# EAGLE design LPC1114 -- Valdez Mutant v.02 (EAGLE 7.0.0)
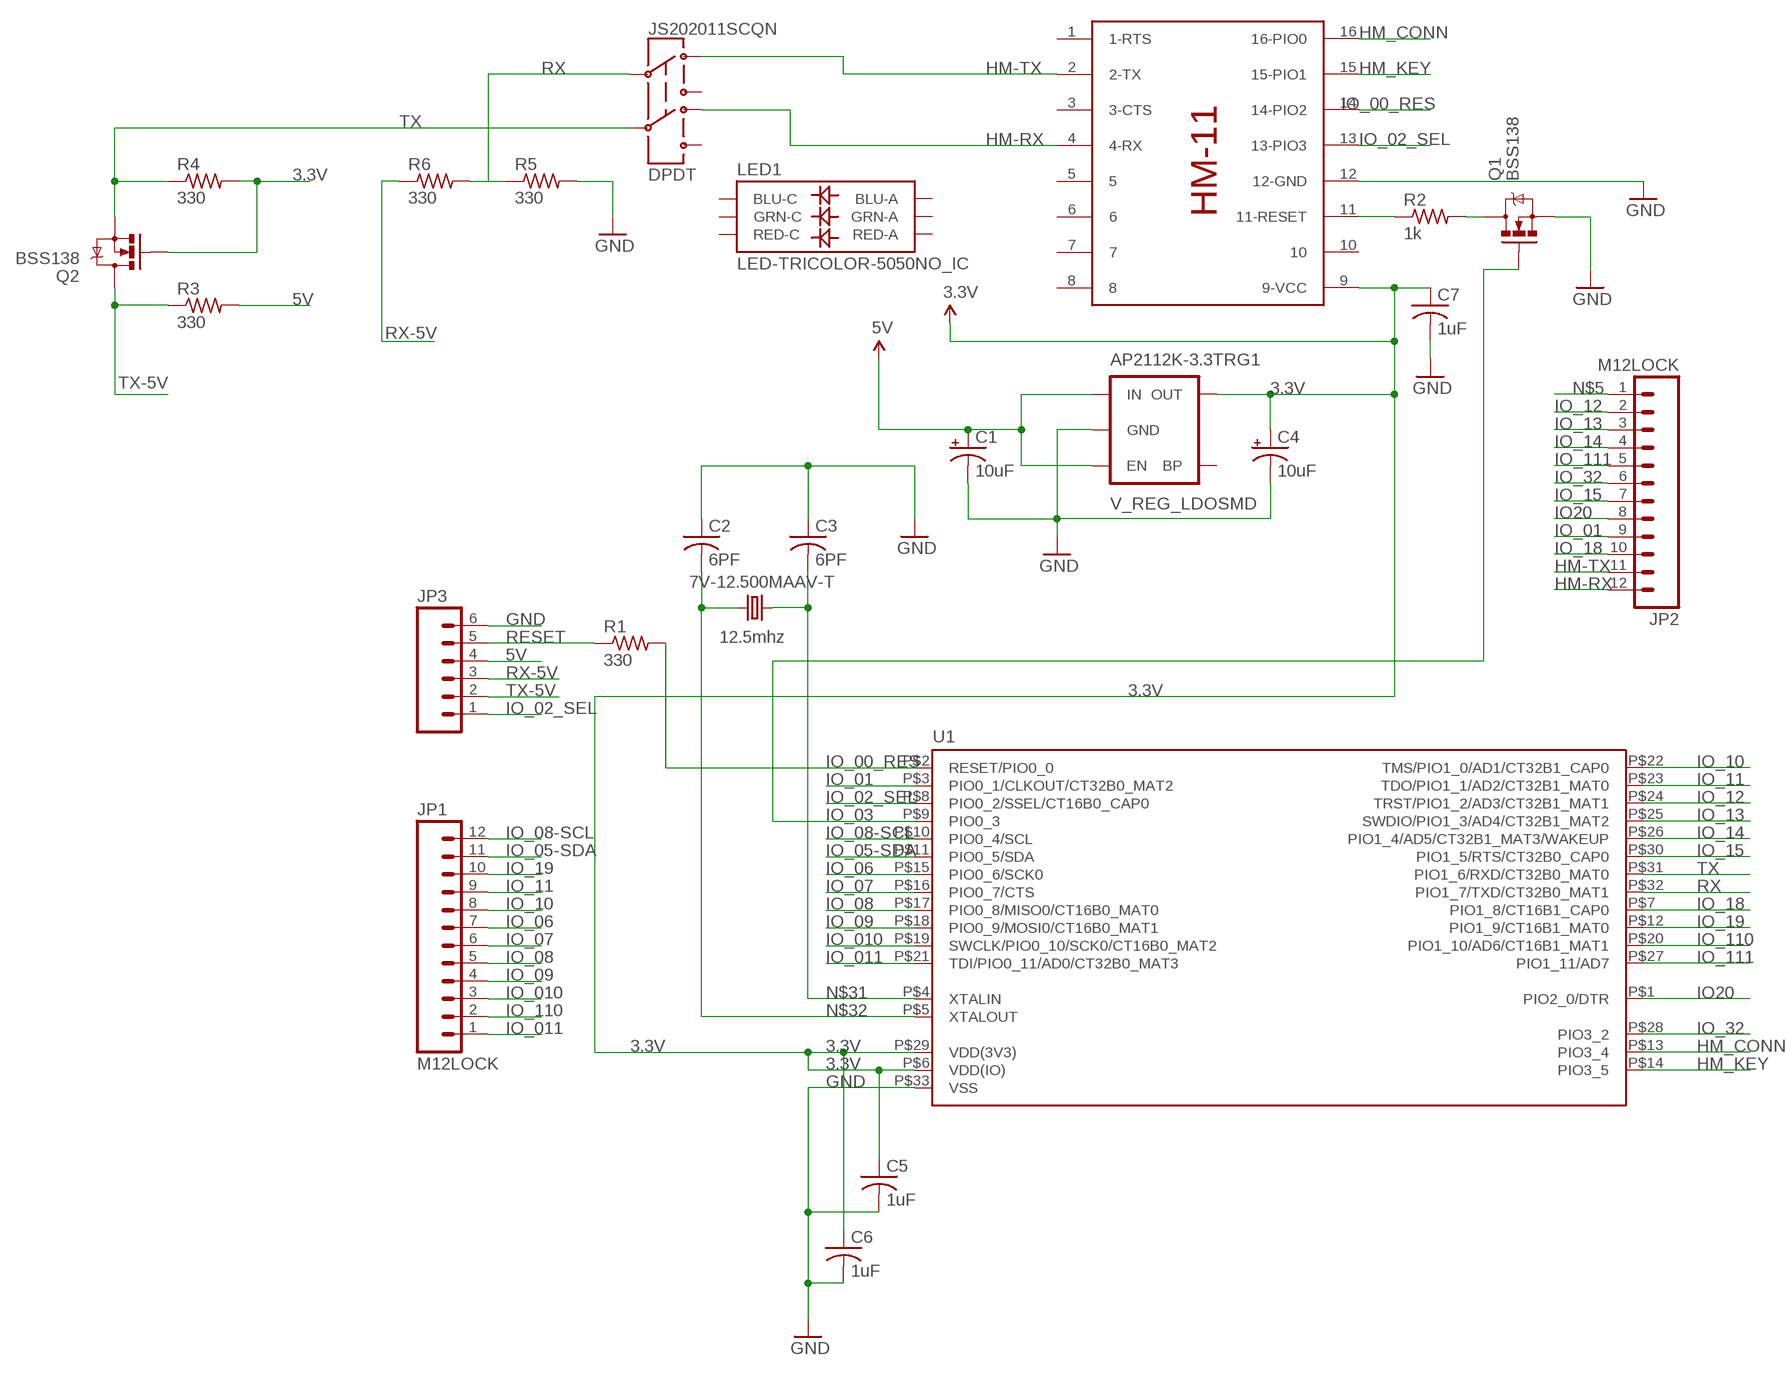
[diagram p0: schematic, sheet 1]

## Parts
7V-12.500MAAV-T  12.5mhz  CRYSTAL5X3  [CRYSTAL-SMD-5X3]
AP2112K-3.3TRG1  V_REG_LDOSMD  [SOT23-5]
C1  10uF  CAP_POL1206  [EIA3216]
C2  6PF  C-USC0402K  [C0402K]
C3  6PF  C-USC0402K  [C0402K]
C4  10uF  CAP_POL1206  [EIA3216]
C5  1uF  C-USC0402K  [C0402K]
C6  1uF  C-USC0402K  [C0402K]
C7  1uF  C-USC0402K  [C0402K]
JP1  M12LOCK  [1X12_LOCK]
JP2  M12LOCK  [1X12_LOCK]
JP3  M06LOCK  [1X06_LOCK]
JS202011SCQN  DPDT  SWITCH-DPDTAYZ0202  [AYZ0202]
LED1  LED-TRICOLOR-5050NO_IC  [LED-TRICOLOR-5050]
Q1  BSS138  MOSFET-NCHANNELBSS138  [SOT23]
Q2  BSS138  MOSFET-NCHANNELBSS138  [SOT23]
R1  330  R-US_R0402  [R0402]
R2  1k  R-US_R0402  [R0402]
R3  330  R-US_R0402  [R0402]
R4  330  R-US_R0402  [R0402]
R5  330  R-US_R0402  [R0402]
R6  330  R-US_R0402  [R0402]
U1  LPC1113/4_QFN  [HVQFN33-7X7]
U$1  HM-11  [HM-11]

## Nets
3.3V: AP2112K-3.3TRG1.5(OUT) C4.A(+) C5.1 C6.1 C7.1 Q2.1(G) R4.2 U1.P$6(VDD(IO)) U1.P$29(VDD(3V3)) U$1.9(9-VCC)
5V: AP2112K-3.3TRG1.1(IN) AP2112K-3.3TRG1.3(EN) C1.A(+) JP3.4 R3.2
GND: AP2112K-3.3TRG1.2(GND) C1.C(-) C2.1 C3.1 C4.C(-) C5.2 C6.2 C7.2 JP3.6 Q1.2(S) R5.2 U1.P$33(VSS) U$1.12(12-GND)
HM-RX: JP2.12 JS202011SCQN.4 U$1.4(4-RX)
HM-TX: JP2.11 JS202011SCQN.1 U$1.2(2-TX)
HM_CONN: U1.P$13(PIO3_4) U$1.16(16-PIO0)
HM_KEY: U1.P$14(PIO3_5) U$1.15(15-PIO1)
IO20: JP2.8 U1.P$1(PIO2_0/DTR)
IO_00_RES: R1.2 U1.P$2(RESET/PIO0_0) U$1.14(14-PIO2)
IO_01: JP2.9 U1.P$3(PIO0_1/CLKOUT/CT32B0_MAT2)
IO_02_SEL: JP3.1 U1.P$8(PIO0_2/SSEL/CT16B0_CAP0) U$1.13(13-PIO3)
IO_03: Q1.1(G) U1.P$9(PIO0_3)
IO_05-SDA: JP1.11 U1.P$11(PIO0_5/SDA)
IO_06: JP1.7 U1.P$15(PIO0_6/SCK0)
IO_07: JP1.6 U1.P$16(PIO0_7/CTS)
IO_08: JP1.5 U1.P$17(PIO0_8/MISO0/CT16B0_MAT0)
IO_08-SCL: JP1.12 U1.P$10(PIO0_4/SCL)
IO_09: JP1.4 U1.P$18(PIO0_9/MOSI0/CT16B0_MAT1)
IO_10: JP1.8 U1.P$22(TMS/PIO1_0/AD1/CT32B1_CAP0)
IO_010: JP1.3 U1.P$19(SWCLK/PIO0_10/SCK0/CT16B0_MAT2)
IO_11: JP1.9 U1.P$23(TDO/PIO1_1/AD2/CT32B1_MAT0)
IO_011: JP1.1 U1.P$21(TDI/PIO0_11/AD0/CT32B0_MAT3)
IO_12: JP2.2 U1.P$24(TRST/PIO1_2/AD3/CT32B1_MAT1)
IO_13: JP2.3 U1.P$25(SWDIO/PIO1_3/AD4/CT32B1_MAT2)
IO_14: JP2.4 U1.P$26(PIO1_4/AD5/CT32B1_MAT3/WAKEUP)
IO_15: JP2.7 U1.P$30(PIO1_5/RTS/CT32B0_CAP0)
IO_18: JP2.10 U1.P$7(PIO1_8/CT16B1_CAP0)
IO_19: JP1.10 U1.P$12(PIO1_9/CT16B1_MAT0)
IO_32: JP2.6 U1.P$28(PIO3_2)
IO_110: JP1.2 U1.P$20(PIO1_10/AD6/CT16B1_MAT1)
IO_111: JP2.5 U1.P$27(PIO1_11/AD7)
N$5: JP2.1
N$8: Q1.3(D) R2.2
N$9: R2.1 U$1.11(11-RESET)
N$31: 7V-12.500MAAV-T.3 C3.2 U1.P$4(XTALIN)
N$32: 7V-12.500MAAV-T.1 C2.2 U1.P$5(XTALOUT)
RESET: JP3.5 R1.1
RX: JS202011SCQN.2 R5.1 R6.2 U1.P$32(PIO1_7/TXD/CT32B0_MAT1)
RX-5V: JP3.3 R6.1
TX: JS202011SCQN.5 Q2.2(S) R4.1 U1.P$31(PIO1_6/RXD/CT32B0_MAT0)
TX-5V: JP3.2 Q2.3(D) R3.1
Unconnected: AP2112K-3.3TRG1.4(BP) JS202011SCQN.3 JS202011SCQN.6 LED1.1(GRN-A) LED1.2(RED-A) LED1.3(BLU-A) LED1.4(BLU-C) LED1.5(RED-C) LED1.6(GRN-C) U$1.1(1-RTS) U$1.3(3-CTS) U$1.5 U$1.6 U$1.7 U$1.8 U$1.10

## Library data of the parts
7V-12.500MAAV-T = SparkFun-FreqCtrl:CRYSTAL: Various standard crystals. Proven footprints. Spark Fun Electronics SKU : COM-00534
AP2112K-3.3TRG1 = SparkFun-PowerIC:V_REG_LDO: Voltage Regulator LDO Standard 150mA LDO voltage regulator in SOT-23 layout. Micrel part MIC5205. BP (by-pass) pin is used to lower output noise with 470pF cap.
C1 C4 = SparkFun-Capacitors:CAP_POL: Capacitor Polarized These are standard SMD and PTH capacitors. Normally 10uF, 47uF, and 100uF in electrolytic and tantalum varieties. Always verify the external diameter of the through hole cap, it varies with capacity, voltage, and manufacturer. The EIA devices should be standard.
C2 C3 C5-C7 = resistor:C-US: CAPACITOR, American symbol
JP1 JP2 = SparkFun-Connectors:M12: Header 12 Standard 12-pin 0.1" header. Use with straight break away headers (SKU : PRT-00116), right angle break away headers (PRT-00553), swiss pins (PRT-00743), machine pins (PRT-00117), and female headers (PRT-00115).
JP3 = SparkFun-Connectors:M06: Header 6 Standard 6-pin 0.1" header. Use with straight break away headers (SKU : PRT-00116), right angle break away headers (PRT-00553), swiss pins (PRT-00743), machine pins (PRT-00117), and female headers (PRT-00115). Molex polarized connector foot print use with SKU : PRT-08094 with associated crimp pins and housings. NOTES ON THE VARIANTS LOCK and LOCK_LONGPADS... This footprint was designed to help hold the alignment of a through-hole component (i.e. 6-pin header) while soldering it into place. You may notice that each hole has been shifted either up or down by 0.005 of an inch from it's more standard position (which is a perfectly straight line). This slight alteration caused the pins (the squares in the middle) to touch the edges of the holes. Because they are alternating, it causes a "brace" to hold the component in place. 0.005 has proven to be the perfect amount of "off-center" position when using our standard breakaway headers. Although looks a little odd when you look at the bare footprint, once you have a header in there, the alteration is very hard to notice. Also,if you push a header all the way into place, it is covered up entirely on the bottom side. This idea of altering the position of holes to aid alignment will be further integrated into the Sparkfun Library for other footprints. It can help hold any component with 3 or more connection pins.
JS202011SCQN = SparkFun-Electromechanical:SWITCH-DPDT: DPDT Version of the COM-00597; PROD_ID: SWCH-08179
LED1 = SparkFun-LED:LED-TRICOLOR-5050
Q1 Q2 = SparkFun-DiscreteSemi:MOSFET-NCHANNEL: Common NMOSFET Parts MFG P/N Store ID Prod ID FDD8780 TRANS-09984 SI7820DN TRANS-11055 FDS6630A IC-08089 2N7002PW TRANS-11151 FQP30N06L COM-10213 TRANS-10060 BSS123LT1G TRANS-08345 BSS138 TRANS-00830 BS170 2N7000; PROD_ID: TRANS-00830
R1-R6 = resistor:R-US_: RESISTOR, American symbol
U1 = microbuilder:LPC1113/4_QFN: LPC1113/4 ARM Cortex-M0 processor, running at frequencies of up to 50 MHz. QFN 33 Pin Package; DIGIKEY#: 568-4948-ND; MANF: NXP; MANF#: LPC1114FHN33/301,5
U$1 = HM-11:HM-11

## Board
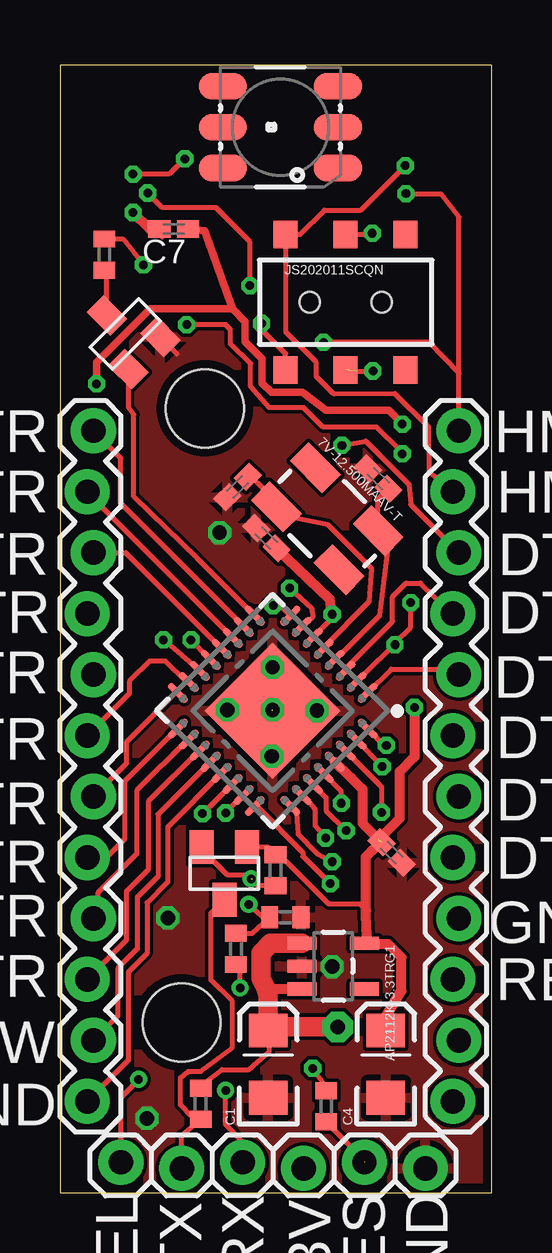
[diagram p1: board, top side]
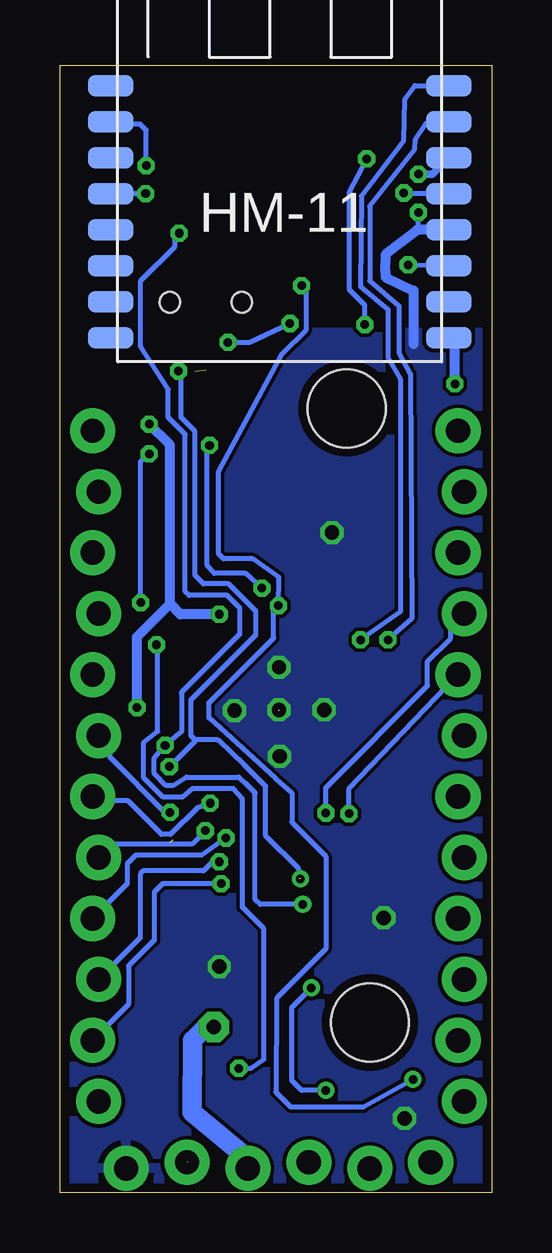
[diagram p2: board, bottom side, seen from below]

Size 18 x 46.97 mm. Coordinates in mm from the lower left corner, seen from the top.
Outline: 0,0 18,0 18,46.97 0,46.97 0,0
Copper layers (1*16): Top 0.0356mm / dielectric 1.5011mm / Bottom 0.0356mm
Design rules "LaenPCBOrder": minimum track width 6mil, minimum drill 13mil, track to track 6mil, track to pad 6mil, pad to pad 6mil, via to via 6mil, smd to smd 6mil, copper to edge 15mil, drill to drill 6mil, minimum pad ring 7mil, minimum via ring 7mil, stop-mask expansion 3mil, vias tented up to drill 0mil, thermal gap 10mil
Holes 3.25 mm at 5.07,7.1 6.04,32.68

### Footprints (pad centres in the part's own frame; a part is rotated, then mirrored left to right if it is on the bottom)
CRYSTAL-SMD-5X3 = smd 1.9 x 1.1: 1 -1.85,-1.15; 2 1.85,-1.15; 3 1.85,1.15; 4 -1.85,1.15
SOT23-5 = smd 0.55 x 1.2: 1 -0.95,-1.3; 2 0,-1.3; 3 0.95,-1.3; 4 0.95,1.3; 5 -0.95,1.3
EIA3216 = smd 1.4 x 1.6: A 1.4,0; C -1.4,0
C0402K = smd 0.925 x 0.74: 1 -0.6,0; 2 0.6,0
1X12_LOCK = drill 1.016 pad 1.88: 1 0,0.127; 2 2.54,-0.127; 3 5.08,0.127; 4 7.62,-0.127; 5 10.16,0.127; 6 12.7,-0.127; 7 15.24,0.127; 8 17.78,-0.127; 9 20.32,0.127; 10 22.86,-0.127; 11 25.4,0.127; 12 27.94,-0.127
1X06_LOCK = drill 1.016 pad 1.88: 1 0,0; 2 2.54,-0.254; 3 5.08,0; 4 7.62,-0.254; 5 10.16,0; 6 12.7,-0.254
AYZ0202 = smd 1 x 1.15: 1 -2.5,2.825; 2 0,2.825; 3 2.5,2.825; 4 -2.5,-2.825; 5 0,-2.825; 6 2.5,-2.825 | hole 0.85: 1.5,0; -1.5,0
LED-TRICOLOR-5050 = smd 2 x 1.1: 1 -2.4,1.7; 2 -2.4,0; 3 -2.4,-1.7; 4 2.4,-1.7; 5 2.4,0; 6 2.4,1.7
SOT23 = smd 1 x 1.4: 1 -0.95,-1.1; 2 0.95,-1.1; 3 0,1.1
R0402 = smd 0.7 x 0.9: 1 -0.65,0; 2 0.65,0
HVQFN33-7X7 = smd 1.067 x 0.3: P$1 -3.327,2.275; P$2 -3.327,1.625; P$3 -3.327,0.975; P$4 -3.327,0.325; P$5 -3.327,-0.325; P$6 -3.327,-0.975; P$7 -3.327,-1.625; P$8 -3.327,-2.275; P$17 3.327,-2.275; P$18 3.327,-1.625; P$19 3.327,-0.975; P$20 3.327,-0.325; P$21 3.327,0.325; P$22 3.327,0.975; P$23 3.327,1.625; P$24 3.327,2.275 | smd 0.3 x 1.067: P$9 -2.275,-3.327; P$10 -1.625,-3.327; P$11 -0.975,-3.327; P$12 -0.325,-3.327; P$13 0.325,-3.327; P$14 0.975,-3.327; P$15 1.625,-3.327; P$16 2.275,-3.327; P$25 2.275,3.327; P$26 1.625,3.327; P$27 0.975,3.327; P$28 0.325,3.327; P$29 -0.325,3.327; P$30 -0.975,3.327; P$31 -1.625,3.327; P$32 -2.275,3.327 | smd 4 x 4: P$33 0,0
HM-11 = smd 1.9 x 0.9: 1 -0.3,11.5; 2 -0.3,10; 3 -0.3,8.5; 4 -0.3,7; 5 -0.3,5.5; 6 -0.3,4; 7 -0.3,2.5; 8 -0.3,1; 9 13.8,1; 10 13.8,2.5; 11 13.8,4; 12 13.8,5.5; 13 13.8,7; 14 13.8,8.5; 15 13.8,10; 16 13.8,11.5

### Placement (x,y rotation side)
7V-12.500MAAV-T  11.15,28.09 315 top
AP2112K-3.3TRG1  11.4,9.44 270 top
C1  8.69,5.36 90 top
C2  7.4,29.41 45 top
C3  13.28,29.75 315 top
C4  13.59,5.36 90 top
C5  13.84,14.18 315 top
C6  8.61,27.27 135 top
C7  4.75,40.16 180 top
JP1  1.27,3.81 90 top
JP2  16.51,3.81 90 top
JP3  2.54,1.27 0 top
JS202011SCQN  11.91,37.11 0 top
LED1  9.19,44.4 180 top
Q1  2.73,35.78 45 top
Q2  6.86,13.31 180 top
R1  11.1,3.61 90 top
R2  1.85,39.09 270 top
R3  5.87,3.71 90 top
R4  8.99,13.44 90 top
R5  9.4,11.48 0 top
R6  7.34,10.16 90 top
U1  8.87,20.08 225 top
U$1  15.59,34.62 0 bottom

### Tracks (layer width: path | path; a pad name or v marks a point on that pad's centre or on a via)
3.3V  (via drill 0.36 pad 0.25)  (1 unrouted)
  Top 0.203: AP2112K-3.3TRG1.5 | 11.35,23.94 U1.P$6 | Q2.1 8.67,14.41 R4.2 9.15,14.09 11.2,12.04 12.49,12.04 12.77,11.76
  Top 0.305: v14.28,32.03 13.72,32.61 11.1,32.61 10.11,33.35 8.81,33.35 8.43,33.73 8.43,34.75 7.72,35.46 7.72,36.3 7.19,36.83 | v1.52,33.71 1.52,34.59 3.76,36.83 7.19,36.83 | 7.19,36.83 6.04,40.08 C7.1
  Top 0.406: U1.P$29 12.14,17.3 12.62,16.82 12.62,15.39 C5.1 13.01,14.25 12.75,13.99 12.77,11.76 12.78,10.95 12.78,10.47 AP2112K-3.3TRG1.5 12.73,10.36 13.69,10.36 14.25,9.8 14.25,8.41 13.61,7.37 C4.A | v14.78,20.22 14.78,18.16 14.17,17.55 14.17,15.6 13.28,14.71 | 11.35,23.94 v11.35,24.11 11.25,24.73 C6.1
  Bottom 0.406: v14.78,20.22 14.78,23.16 13.41,24.54 | 13.41,24.54 13.41,31.17 v14.28,32.03 | v1.52,33.71 1.52,35.36 U$1.9 | 11.23,23.98 v11.35,24.11 12.98,24.11 13.41,24.54
5V  (via drill 0.6 pad 1.27)
  Top 0.203: AP2112K-3.3TRG1.3 | 8.84,6.91 C1.A 8.74,6.71 8.74,5.89 7.87,5.13 6.76,5.13 5.93,4.51 R3.2
  Top 0.406: 8.59,8.51 9.68,8.51 AP2112K-3.3TRG1.3
  Top 0.813: 8.77,6.68 C1.A 8.69,8.18 8.59,8.51 8.38,8.94 8.38,9.98 8.79,10.39 AP2112K-3.3TRG1.1 | v11.58,6.91 8.84,6.91
  Bottom 0.813: JP3.4 10.16,1.42 12.5,3.35 12.47,6.35 11.91,6.91 v11.58,6.91
GND  (via drill 0.36, 0.6 pad 0.81)  (1 unrouted)
  Top 0.203: 3.73,40.16 C7.2 4.15,39.95 4.27,39.83 | Q1.2 4.18,35.64 4.88,34.95
  Top 0.406: 3.73,40.16 v3.05,40.84
  Bottom 0.203: 3.06,40.12 3.06,40.42 v3.05,40.84
  Bottom 0.406: 3.25,35.36 3.25,37.59 4.42,38.15 4.42,38.36 4.4,39.12 3.12,40.11 3.06,40.12 U$1.12
  other vias: 8.86,20.12 8.86,21.89 10.72,20.09 8.84,18.19 6.99,20.12 3.63,3.1 11.35,9.42 4.5,11.46 6.65,27.51
  pour Bottom: 0,35.86 0,0 17.78,0 17.78,35.86
  pour Top: 0.2,36.07 0,0 17.78,0 17.98,36.07
HM-RX  (via drill 0.36, 0.36 pad 0.25)
  Top 0.203: JS202011SCQN.4 9.41,34.96 8.46,35.92 8.46,36.17 v8.41,36.22 | JP2.12 16.64,34.14 | 16.64,34.14 16.64,40.66 15.9,41.6 14.45,41.6 v14.43,41.63 | 16.64,34.14 15.39,35.43 v11,35.43
  Bottom 0.203: v14.43,41.63 15.88,41.63 U$1.4 | v11,35.43 10.08,35.43 v8.41,36.22
HM-TX  (via drill 0.36 pad 0.25)
  Top 0.203: v14.4,42.8 12.55,40.95 11.02,40.95 10.01,39.93 JS202011SCQN.1 9.42,39.92 9.42,35.87 10.69,34.59 10.69,34.01 11.43,33.27 13.97,33.3 15.37,31.93 15.39,30.07 JP2.11
  Bottom 0.203: v14.4,42.8 14.4,44.27 14.66,44.53 15.79,44.53 U$1.2
HM_CONN  (via drill 0.36 pad 0.25)
  Top 0.203: U1.P$13 6.22,22.2 6.22,22.28 v5.46,23.04
  Bottom 0.203: U$1.16 3.2,46.13 3.61,45.57 3.66,43.84 5.44,41.53 5.46,37.77 4.32,36.8 4.32,34.8 3.81,33.91 3.81,24.21 v5.46,23.04
HM_KEY  (via drill 0.36 pad 0.25)
  Top 0.203: U1.P$14 5.83,21.76 v4.32,23.04
  Bottom 0.203: U$1.15 1.86,44.55 2.74,44.55 3.17,43.89 3.2,43.48 5.08,41.12 5.08,38 3.86,36.96 3.86,35 3.38,34.11 3.33,23.93 v4.32,23.04
IO20
  Top 0.203: U1.P$1 13.82,21.82 16.41,21.82 JP2.8
IO_00_RES  (via drill 0.36, 0.36 pad 0.25)
  Top 0.203: 12.37,21.31 U1.P$2 13.11,22.02 v13.97,22.84 13.97,22.91 14.63,23.57 v14.63,24.59 | v14.28,30.79 14.22,30.89 13.21,31.9 10.97,31.9 10.16,32.72 8.74,32.72 7.95,33.6 7.95,34.54 7.11,35.36 7.11,35.97 6.91,36.17 v5.28,36.17 | v5.21,43.08 4.55,42.44 v3.05,42.44 | 11.19,4.31 R1.2 11.1,4.42 v10.54,5.18
  Bottom 0.203: v13.97,22.84 13.92,22.78 13.92,19.23 14.5,18.77 14.5,17.3 13.69,16.48 12.88,16.48 12.47,16.84 10.77,16.84 10.39,16.41 10.39,11.89 9.5,11 9.5,5.56 10.03,5.18 v10.54,5.18 | v14.63,24.59 14.63,30.48 v14.28,30.79 | v5.28,36.17 5.28,36.98 5.92,37.62 5.92,41.71 v5.21,43.08
  Bottom 0.305: v3.05,42.44 2.46,42.44 U$1.14
IO_01
  Top 0.203: U1.P$3 11.91,21.84 13.87,23.8 13.87,24.84 14.43,25.4 15.04,25.4 15.65,24.79 16.26,24.21 JP2.9
IO_02_SEL  (via drill 0.36, 0.36 pad 0.25)
  Top 0.203: v8.89,24.46 9.3,24.36 U1.P$8 | v7.92,37.8 7.92,39.62 6.5,41.05 4.27,41.05 v3.66,41.66 | v3.28,4.72 3.28,4.7 2.54,3.96 JP3.1
  Bottom 0.203: v7.92,37.8 7.72,37.59 7.72,35.97 8.74,34.95 11.38,30.07 11.38,26.62 11.18,26.42 9.96,26.42 8.87,25.65 v8.89,24.46 9.09,24.28 9.09,23.11 11.79,20.42 11.79,19.79 8.99,17.25 8.33,16.66 8.33,15.44 6.91,14.02 6.91,10.16 8.97,8.1 8.99,4.19 8.38,3.58 5.33,3.58 v3.28,4.72 | v3.66,41.66 1.82,41.66 U$1.13
IO_03
  Top 0.203: U1.P$9 8.11,24.04 5.71,26.44 3.07,29.01 3.07,32.44 2.87,32.72 2.87,33.84 Q1.1
IO_05-SDA
  Top 0.203: JP1.11 1.14,29.19 U1.P$11
IO_06
  Top 0.203: U1.P$15 5.26,21.29 4.39,22.15 3.73,22.15 2.9,21.31 2.9,20.8 JP1.7
IO_07
  Top 0.203: U1.P$16 4.82,20.82 2.77,18.77 2.77,17.88 JP1.6
IO_08
  Top 0.203: U1.P$17 4.88,19.34 2.69,17.14 2.69,14.73 1.85,13.89 1.22,13.89 JP1.5
IO_08-SCL
  Top 0.203: U1.P$10 7.67,23.6 2.54,28.73 2.54,30.61 JP1.12
IO_09
  Top 0.203: U1.P$18 5.31,18.88 3.2,16.76 3.2,14.12 1.57,12.5 1.57,11.61 JP1.4
IO_10  (via drill 0.36 pad 0.25)
  Top 0.203: U1.P$22 v5.94,15.8
  Bottom 0.203: v5.94,15.8 5.94,16.84 JP1.8
IO_010
  Top 0.203: U1.P$19 5.79,18.42 3.68,16.31 3.68,13.46 2.77,12.55 2.77,10.52 JP1.3
IO_11  (via drill 0.36 pad 0.25)
  Top 0.203: U1.P$23 7.61,16.58 v6.91,15.82
  Bottom 0.203: v6.91,15.82 6.91,16.87 2.67,21.13 2.67,22.15 1.7,23.11 1.7,23.57 JP1.9
IO_011
  Top 0.203: U1.P$21 4.5,15.24 4.5,12.95 3.63,12.09 3.63,9.98 2.85,9.2 2.85,5.51 JP1.1
IO_12  (via drill 0.36 pad 0.25)
  Top 0.203: U1.P$24 8.19,16.12 10.13,14.17 10.13,14.02 v11.28,12.88
  Bottom 0.203: v11.28,12.88 13.72,12.88 14.07,12.52 14.07,10.52 15.14,9.45 15.14,7.85 JP2.2
IO_13  (via drill 0.36 pad 0.25)
  Top 0.203: U1.P$25 9.87,15.81 9.93,14.94 10.72,14.12 v11.35,13.79
  Bottom 0.203: v11.35,13.79 11.43,13.99 12.01,13.41 14.53,13.41 14.66,13.28 14.66,10.62 JP2.3
IO_14  (via drill 0.36 pad 0.25)
  Top 0.203: U1.P$26 10.12,16.58 10.64,15.98 10.64,15.29 v11.07,14.78
  Bottom 0.203: v11.07,14.78 12.09,14.07 14.83,14.07 15.19,13.72 15.19,12.88 JP2.4
IO_15  (via drill 0.36 pad 0.25)
  Top 0.203: U1.P$30 13.41,16.92 v13.41,15.85
  Bottom 0.203: v13.41,15.85 13.56,15.8 15.93,18.16 15.85,18.52 JP2.7
IO_18  (via drill 0.36 pad 0.25)
  Top 0.203: U1.P$7 10.05,23.54 10.57,24.03 10.52,24.33 v9.58,25.2 | v11.76,31.14 12.75,31.32 14.55,29.52 14.63,28.68 JP2.10
  Bottom 0.203: v9.58,25.2 10.26,25.81 11.56,25.81 11.86,26.14 11.86,31.04 v11.76,31.14
IO_19
  Top 0.203: JP1.10 2.74,26.67 U1.P$12
IO_32  (via drill 0.36 pad 0.25)
  Top 0.203: U1.P$28 10.99,17.48 11.71,16.74 11.71,16.36 v11.73,16.23
  Bottom 0.203: v11.73,16.23 12.27,16.05 13.39,14.94 13.77,14.94 15.16,16.33 16.46,16.33 JP2.6
IO_110
  Top 0.203: U1.P$20 6.28,17.96 4.09,15.77 4.09,13.18 3.23,12.32 3.23,10.16 2.41,9.35 2.41,7.37 JP1.2
IO_111  (via drill 0.36 pad 0.25)
  Top 0.203: U1.P$27 10.53,17.03 11.1,16.46 11.1,15.93 v11.94,15.09
  Bottom 0.203: v11.94,15.09 12.5,14.53 15.82,14.53 JP2.5
N$8
  Top 0.203: Q1.3 1.96,38.34 R2.2
N$9  (via drill 0.36 pad 0.25)
  Top 0.203: R2.1 2.63,39.74 v3.48,38.66
  Bottom 0.203: v3.48,38.66 1.8,38.63 U$1.11
N$31
  Top 0.203: U1.P$4 11.48,22.2 13.34,24.05 13.59,26.11 13.69,26.92 7V-12.500MAAV-T.3 13.27,28.9 C3.2
N$32
  Top 0.203: U1.P$5 10.99,22.7 12.9,24.64 13.01,26.01 11.18,27.84 9.41,28.19 7V-12.500MAAV-T.1 9.03,28.79 8.26,29.57 7.85,29.88 C2.2
RESET  (1 unrouted)
  Top 0.203: 12.7,1.29 12.7,1.36 R1.1
RX  (via drill 0.36, 0.36 pad 0.25)
  Top 0.203: U1.P$32 12.87,19.34 13.18,18.97 13.51,18.64 v13.61,18.64 | JS202011SCQN.2 12.98,39.93 v13.03,39.98 | R6.2 8,10.81 R5.1 8.46,11.48 v7.87,12.01
  Bottom 0.203: v13.03,39.98 13.21,39.8 13.21,39.42 14.63,38 14.63,35.26 13.49,33.48 13.49,32.31 12.78,31.6 12.78,25.04 12.62,24.89 11.02,24.89 10.49,24.36 10.49,23.29 12.93,20.85 12.93,19.2 v13.61,18.64 14.07,18.11 14.07,17.48 13.56,16.97 13.28,16.97 12.72,17.32 10.54,17.32 10.24,17.04 9.86,16.66 9.86,12.22 9.65,12.01 v7.87,12.01
RX-5V  (via drill 0.36)
  Top 0.203: JP3.3 7.62,2.13 6.91,2.85 v6.91,4.27 | v7.52,8.53 7.52,9.33 R6.1
  Bottom 0.203: v6.91,4.27 7.92,4.27 8.33,4.67 8.33,7.72 v7.52,8.53
TX  (via drill 0.36, 0.36 pad 0.25)  (2 unrouted)
  Top 0.203: U1.P$31 v13.44,17.75 | 12.37,34.24 v13.06,34.24 | Q2.2 5.91,14.31 6.96,13.26 7.8,13.26 v7.98,13.08 8.27,12.79 R4.1
  Bottom 0.203: v13.06,34.24 12.95,33.93 12.95,32.31 12.37,31.73 12.37,25.73 12.01,25.38 10.97,25.38 9.83,24.23 9.83,23.24 12.55,20.52 12.55,19.05 U1.P$31 | U1.P$31 11.43,18.87 11.38,18.85 10.31,17.8 9.78,17.3 9.42,16.94 9.42,14.88 8.04,13.5 8.04,13.08 | U1.P$31 12.37,18.82 v13.44,17.75
TX-5V
  Top 0.203: JP3.2 5.08,2.4 R3.1 5.48,3.21 5.03,3.66 5.03,4.8 5.33,5.05 5.87,5.05 7.19,6.04 7.19,7.98 6.3,8.87 6.3,11.65 Q2.3

### Text on the board
tNames: DTR | HM-RX | DTR | HM-TX | DTR | DTR | DTR | DTR | DTR | DTR | DTR | DTR | DTR | DTR | DTR | DTR | DTR | GND | DTR | RESET | RAW | GND | TX | RX | 3.3V | GND | DTR/SEL | CTS/RES